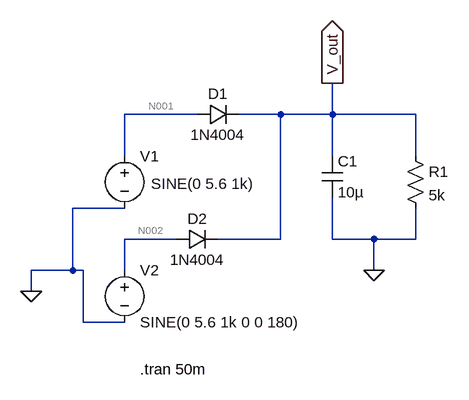
[diagram p0: schematic CircuitoRectificador.asc]
CircuitoRectificador.asc, the LTspice schematic file:
Version 4.1
SHEET 1 880 680
WIRE 160 80 48 80
WIRE 288 80 224 80
WIRE 368 80 368 32
WIRE 368 80 288 80
WIRE 496 80 368 80
WIRE 48 144 48 80
WIRE 368 144 368 80
WIRE 496 144 496 80
WIRE 48 224 -32 224
WIRE 128 272 48 272
WIRE 288 272 288 80
WIRE 288 272 192 272
WIRE 368 272 368 208
WIRE 432 272 368 272
WIRE 496 272 496 224
WIRE 496 272 432 272
WIRE -32 320 -32 224
WIRE -32 320 -96 320
WIRE -16 320 -32 320
WIRE 48 320 48 272
WIRE 432 320 432 272
WIRE -96 352 -96 320
WIRE -16 400 -16 320
WIRE 48 400 -16 400
FLAG -96 352 0
FLAG 368 32 V_out
IOPIN 368 32 Out
FLAG 432 320 0
SYMBOL voltage 48 128 R0
WINDOW 123 0 0 Left 0
WINDOW 39 0 0 Left 0
WINDOW 3 41 59 Left 2
SYMATTR Value SINE(0 5.6 1k)
SYMATTR InstName V1
SYMBOL diode 160 96 R270
WINDOW 0 32 32 VTop 2
WINDOW 3 0 32 VBottom 2
SYMATTR InstName D1
SYMATTR Value 1N4004
SYMBOL cap 352 144 R0
SYMATTR InstName C1
SYMATTR Value 10µ
SYMBOL res 480 128 R0
SYMATTR InstName R1
SYMATTR Value 5k
SYMBOL voltage 48 304 R0
WINDOW 123 0 0 Left 0
WINDOW 39 0 0 Left 0
SYMATTR InstName V2
SYMATTR Value SINE(0 5.6 1k 0 0 180)
SYMBOL diode 128 288 R270
WINDOW 0 32 32 VTop 2
WINDOW 3 0 32 VBottom 2
SYMATTR InstName D2
SYMATTR Value 1N4004
TEXT 72 472 Left 2 !.tran 50m

The netlist it stands for:
* CircuitoRectificador.asc
V1 N001 0 SINE(0 5.6 1k)
D1 N001 V_out 1N4004
C1 V_out 0 10µ
R1 V_out 0 5k
V2 N002 0 SINE(0 5.6 1k 0 0 180)
D2 N002 V_out 1N4004
.model D D
.lib standard.dio
.tran 50m
.backanno
.end

* Results of the author's LTspice run, read from the files saved beside the schematic
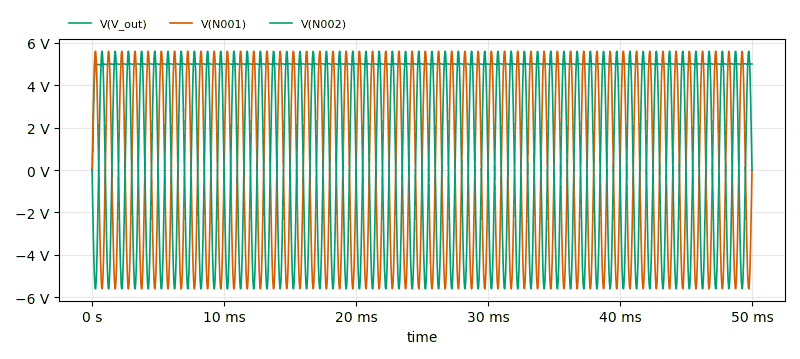
[diagram p1: Transient Analysis of CircuitoRectificador.asc, plotted from the saved traces]
* Transient Analysis, 1 run:
*   V(V_out): min 0 V, max 5.022 V, average 4.986 V, rms 4.99 V, last 4.995 V
*   V(N001): min -5.6 V, max 5.6 V, average 1.069 mV, rms 3.971 V, last 0 V
*   V(N002): min -5.6 V, max 5.6 V, average -1.069 mV, rms 3.971 V, last 0 V